# EAGLE schematic temp (EAGLE 8.4.1)
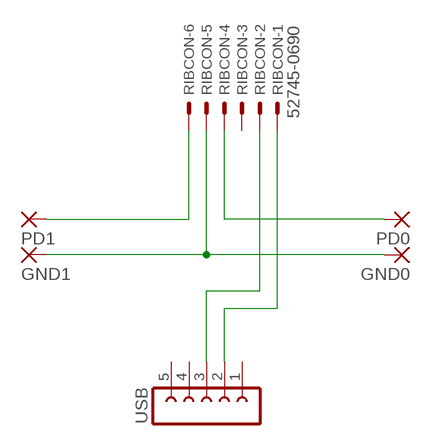
[diagram p0: schematic, sheet 1]

## Parts
GND0  SMD5  [SMD2,54-5,08]
GND1  SMD5  [SMD2,54-5,08]
PD0  SMD5  [SMD2,54-5,08]
PD1  SMD5  [SMD2,54-5,08]
RIBCON  52745-0690  [52745-0690]
USB  FE05-1  [FE05-1]

## Nets
D+: RIBCON.2 USB.3
D-: RIBCON.1 USB.2
GND: GND0.1(P) GND1.1(P) RIBCON.5
PD0: PD0.1(P) RIBCON.4
PD1: PD1.1(P) RIBCON.6
Unconnected: RIBCON.3 USB.1 USB.4 USB.5

## Library data of the parts
GND0 GND1 PD0 PD1 = wirepad:SMD5: SMD PAD
RIBCON = con-molex:52745-0690: FFC/FPC-to-Board 0.50mm (.020") SMT Top Contact Right Angle, ZIF, Style Receptacle 52745 / 52435 Source: http://www.molex.com/product/ffc/52745.html; MPN: 52745-0690; OC_FARNELL: unknown; OC_NEWARK: 92M6374
USB = con-lsta:FE05-1: FEMALE HEADER; OC_FARNELL: unknown; OC_NEWARK: unknown